# Altium schematic sheet YLXC.SchDoc
size A4; SheetNumber: 1; SheetTotal: 1
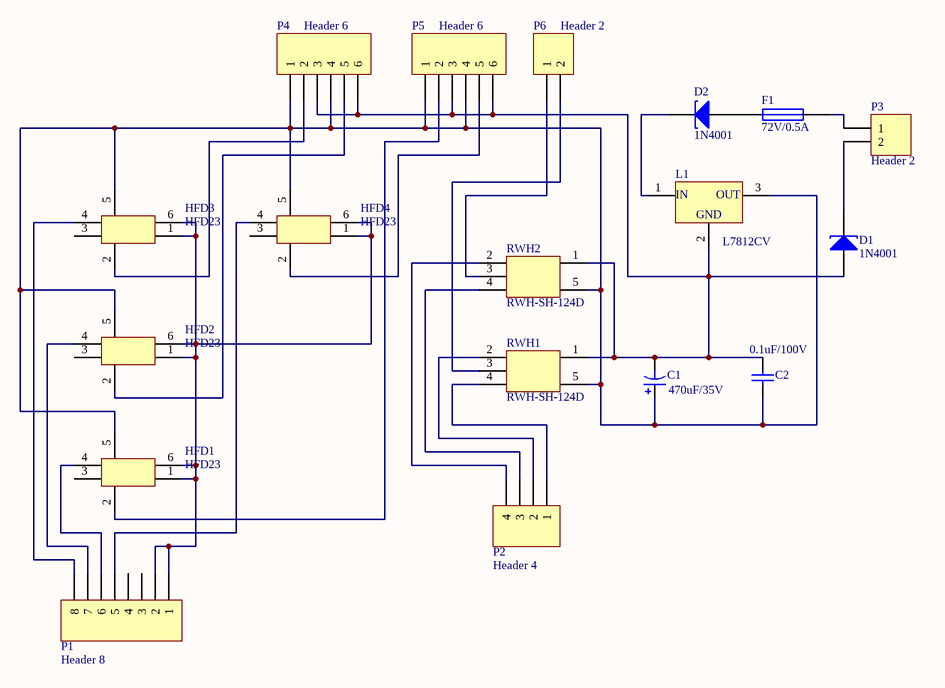
[diagram p0: YLXC.SchDoc]

## Parts
C1  value 470uF/35V  [Cap Pol2]  (hidden comment: Cap Pol2)
C2  value 0.1uF/100V  [Cap]  (hidden comment: Cap)
D1  1N4001  [DIODE-0.4]
D2  1N4001  [DIODE-0.4]
F1  72V/0.5A  [Fuse 1]
HFD1  HFD23  [HFD23 012-12S]
HFD2  HFD23  [HFD23 012-12S]
HFD3  HFD23  [HFD23 012-12S]
HFD4  HFD23  [HFD23 012-12S]
L1  L7812CV  [LM7812]
P1  Header 8  [HDR1X8]
P2  Header 4  [HDR1X4]
P3  Header 2  [HDR1X2]
P4  Header 6  [HDR1X6]
P5  Header 6  [HDR1X6]
P6  Header 2  [HDR1X2]
RWH1  RWH-SH-124D  [RWH-SH-124D]
RWH2  RWH-SH-124D  [RWH-SH-124D]

## Nets
NetC1_1: C1.1 C2.1 HFD1.5 HFD2.5 HFD3.5 HFD4.5 L1.3 P4.1 P4.4 P5.1 P5.4 RWH1.5 RWH2.5
NetC1_2: C1.2 C2.2 D1.1(A) L1.2 P4.3 P4.6 P5.3 P5.6 RWH1.1 RWH2.1
NetD1_2: D1.2(K) P3.2
NetD2_1: D2.1(A) F1.1
NetD2_2: D2.2(K) L1.1
NetF1_2: F1.2 P3.1
NetHFD1_1: HFD1.1 HFD1.6 HFD2.1 HFD2.6 HFD3.1 HFD3.6 HFD4.1 HFD4.6 P1.1 P1.2
NetHFD1_2: HFD1.2 P5.2
NetHFD1_4: HFD1.4 P1.6
NetHFD2_2: HFD2.2 P4.5
NetHFD2_4: HFD2.4 P1.7
NetHFD3_2: HFD3.2 P4.2
NetHFD3_4: HFD3.4 P1.8
NetHFD4_2: HFD4.2 P5.5
NetHFD4_4: HFD4.4 P1.5
NetP2_1: P2.1 RWH1.4
NetP2_2: P2.2 RWH1.2
NetP2_3: P2.3 RWH2.4
NetP2_4: P2.4 RWH2.2
NetP6_1: P6.1 RWH2.3
NetP6_2: P6.2 RWH1.3

Not connected (* = marked no-connect by the designer): HFD1 3; HFD2 3; HFD3 3; HFD4 3; P1 3 4

## Notes on the sheet
- (in symbol LM7812) IN; OUT; GND

## Library data of the parts
C1 = Cap Pol2: Polarized Capacitor (Axial); Published: 8-Jun-2000; LatestRevisionDate: 17-Jul-2002; LatestRevisionNote: Re-released for DXP Platform.; PackageReference: POLAR0.8; Publisher: Altium Limited; PackageDescription: Polarized Capacitor; 2 Leads
C2 = Cap: Capacitor; Published: 8-Jun-2000; LatestRevisionDate: 17-Jul-2002; LatestRevisionNote: Re-released for DXP Platform.; PackageReference: RAD-0.3; Publisher: Altium Limited; PackageDescription: Radial Cap, Thru-Hole; 2 Leads; 0.3 in Pin Spacing
D1 D2 = D Tunnel2: Tunnel Diode - Dependent Source Model; Published: 15-Apr-2002; LatestRevisionDate: 17-Jul-2002; LatestRevisionNote: Re-released for DXP Platform.; PackageReference: DIODE-0.4; Publisher: Altium Limited; PackageDescription: Diode, Thru-Hole; 2 Leads; 0.4 in Pin Spacing
F1 = Fuse 1: Fuse; Published: 8-Jun-2000; LatestRevisionDate: 17-Jul-2002; LatestRevisionNote: Re-released for DXP Platform.; PackageReference: PIN-W2/E2.8; Publisher: Altium Limited; PackageDescription: Thru-Hole; 2 Leads
L1 = LM7812
P1 = Header 8: Header, 8-Pin; LatestRevisionDate: 17-Jul-2002; LatestRevisionNote: Re-released for DXP Platform.; Publisher: Altium Limited
P2 = Header 4: Header, 4-Pin; LatestRevisionDate: 17-Jul-2002; LatestRevisionNote: Re-released for DXP Platform.; Publisher: Altium Limited
P3 P6 = Header 2: Header, 2-Pin; LatestRevisionDate: 17-Jul-2002; LatestRevisionNote: Re-released for DXP Platform.; Publisher: Altium Limited
P4 P5 = Header 6: Header, 6-Pin; LatestRevisionDate: 17-Jul-2002; LatestRevisionNote: Re-released for DXP Platform.; Publisher: Altium Limited